# EAGLE design W024 (EAGLE 6.6.0)
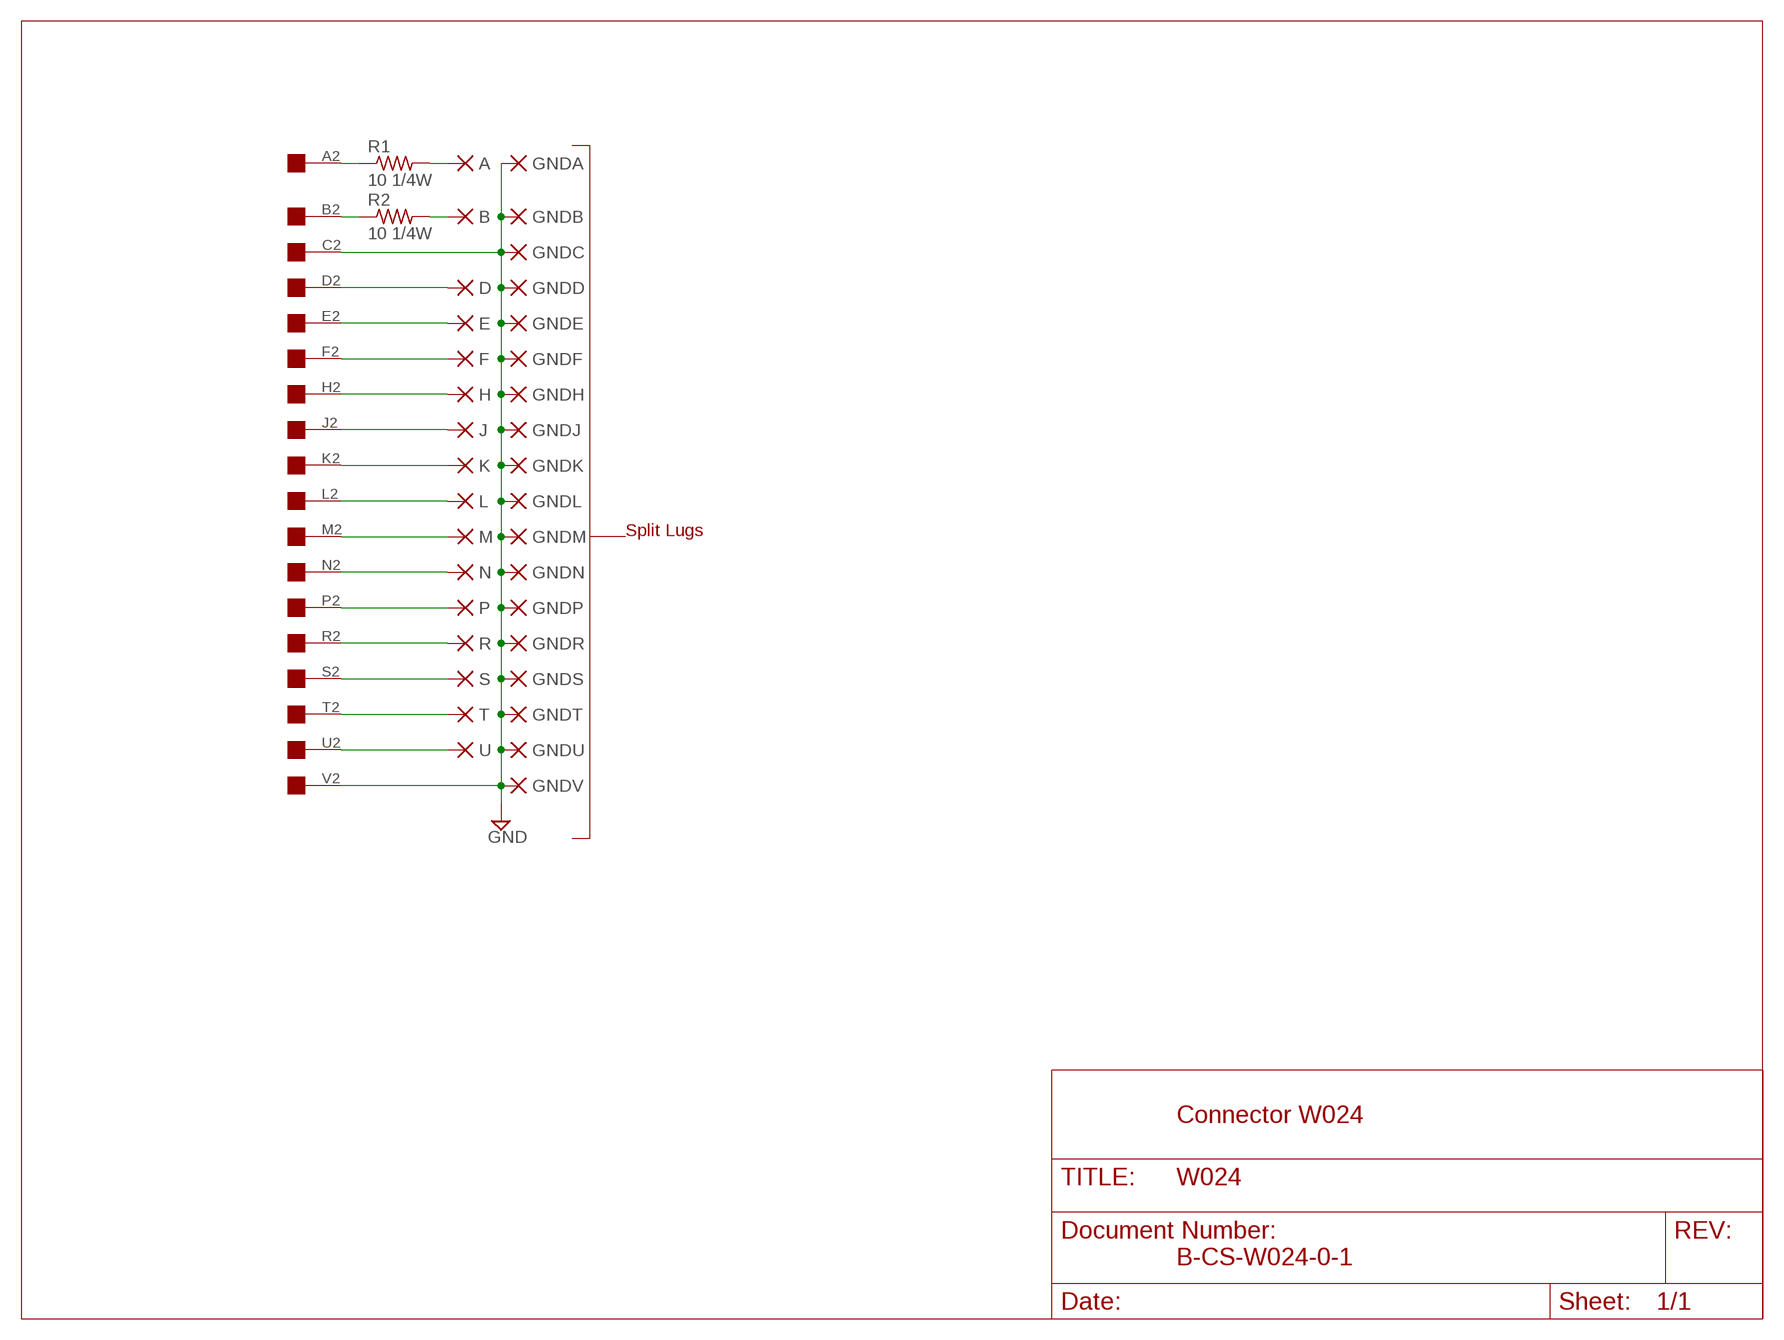
[diagram p0: schematic, sheet 1]

## Parts
A  PAD-0465  [0465]
B  PAD-0465  [0465]
D  PAD-0465  [0465]
E  PAD-0465  [0465]
F  PAD-0465  [0465]
GNDA  PAD-0465  [0465]
GNDB  PAD-0465  [0465]
GNDC  PAD-0465  [0465]
GNDD  PAD-0465  [0465]
GNDE  PAD-0465  [0465]
GNDF  PAD-0465  [0465]
GNDH  PAD-0465  [0465]
GNDJ  PAD-0465  [0465]
GNDK  PAD-0465  [0465]
GNDL  PAD-0465  [0465]
GNDM  PAD-0465  [0465]
GNDN  PAD-0465  [0465]
GNDP  PAD-0465  [0465]
GNDR  PAD-0465  [0465]
GNDS  PAD-0465  [0465]
GNDT  PAD-0465  [0465]
GNDU  PAD-0465  [0465]
GNDV  PAD-0465  [0465]
H  PAD-0465  [0465]
J  PAD-0465  [0465]
K  PAD-0465  [0465]
L  PAD-0465  [0465]
M  PAD-0465  [0465]
N  PAD-0465  [0465]
P  PAD-0465  [0465]
R  PAD-0465  [0465]
R1  10 1/4W  R-US_0207/10  [0207/10]
R2  10 1/4W  R-US_0207/10  [0207/10]
S  PAD-0465  [0465]
T  PAD-0465  [0465]
U  PAD-0465  [0465]
U$2  EDGE-1  [EDGE-CON1]

## Nets
GND [Supply]: GNDA.P$1(P) GNDB.P$1(P) GNDC.P$1(P) GNDD.P$1(P) GNDE.P$1(P) GNDF.P$1(P) GNDH.P$1(P) GNDJ.P$1(P) GNDK.P$1(P) GNDL.P$1(P) GNDM.P$1(P) GNDN.P$1(P) GNDP.P$1(P) GNDR.P$1(P) GNDS.P$1(P) GNDT.P$1(P) GNDU.P$1(P) GNDV.P$1(P) U$2.C2 U$2.V2
N$1 [Supply]: E.P$1(P) U$2.E2
N$2 [Supply]: H.P$1(P) U$2.H2
N$3 [Supply]: K.P$1(P) U$2.K2
N$4 [Supply]: M.P$1(P) U$2.M2
N$5 [Supply]: P.P$1(P) U$2.P2
N$6 [Supply]: S.P$1(P) U$2.S2
N$7 [Supply]: T.P$1(P) U$2.T2
N$9: D.P$1(P) U$2.D2
N$10: R2.1 U$2.B2
N$11: R1.1 U$2.A2
N$12: A.P$1(P) R1.2
N$13: B.P$1(P) R2.2
N$15 [Supply]: F.P$1(P) U$2.F2
N$16 [Supply]: J.P$1(P) U$2.J2
N$17 [Supply]: L.P$1(P) U$2.L2
N$18 [Supply]: N.P$1(P) U$2.N2
N$19 [Supply]: R.P$1(P) U$2.R2
N$20 [Supply]: U$2.U2 U.P$1(P)

## Notes on the sheet
- Split Lugs
- Connector W024
- B-CS-W024-0-1

## Library data of the parts
A B D E F GNDA GNDB GNDC GNDD GNDE GNDF GNDH GNDJ GNDK GNDL GNDM GNDN GNDP GNDR GNDS GNDT GNDU GNDV H J K L M N P R S T U = dec-con:PAD: WIRE PAD Standard US Drill Sizes
R1 R2 = rcl:R-US_: RESISTOR, American symbol
U$2 = dec-con:EDGE-1: Single-Sided DEC Edge Connector -- (side 2)

## Net classes
1 Supply: width 0.813 mm

## Board
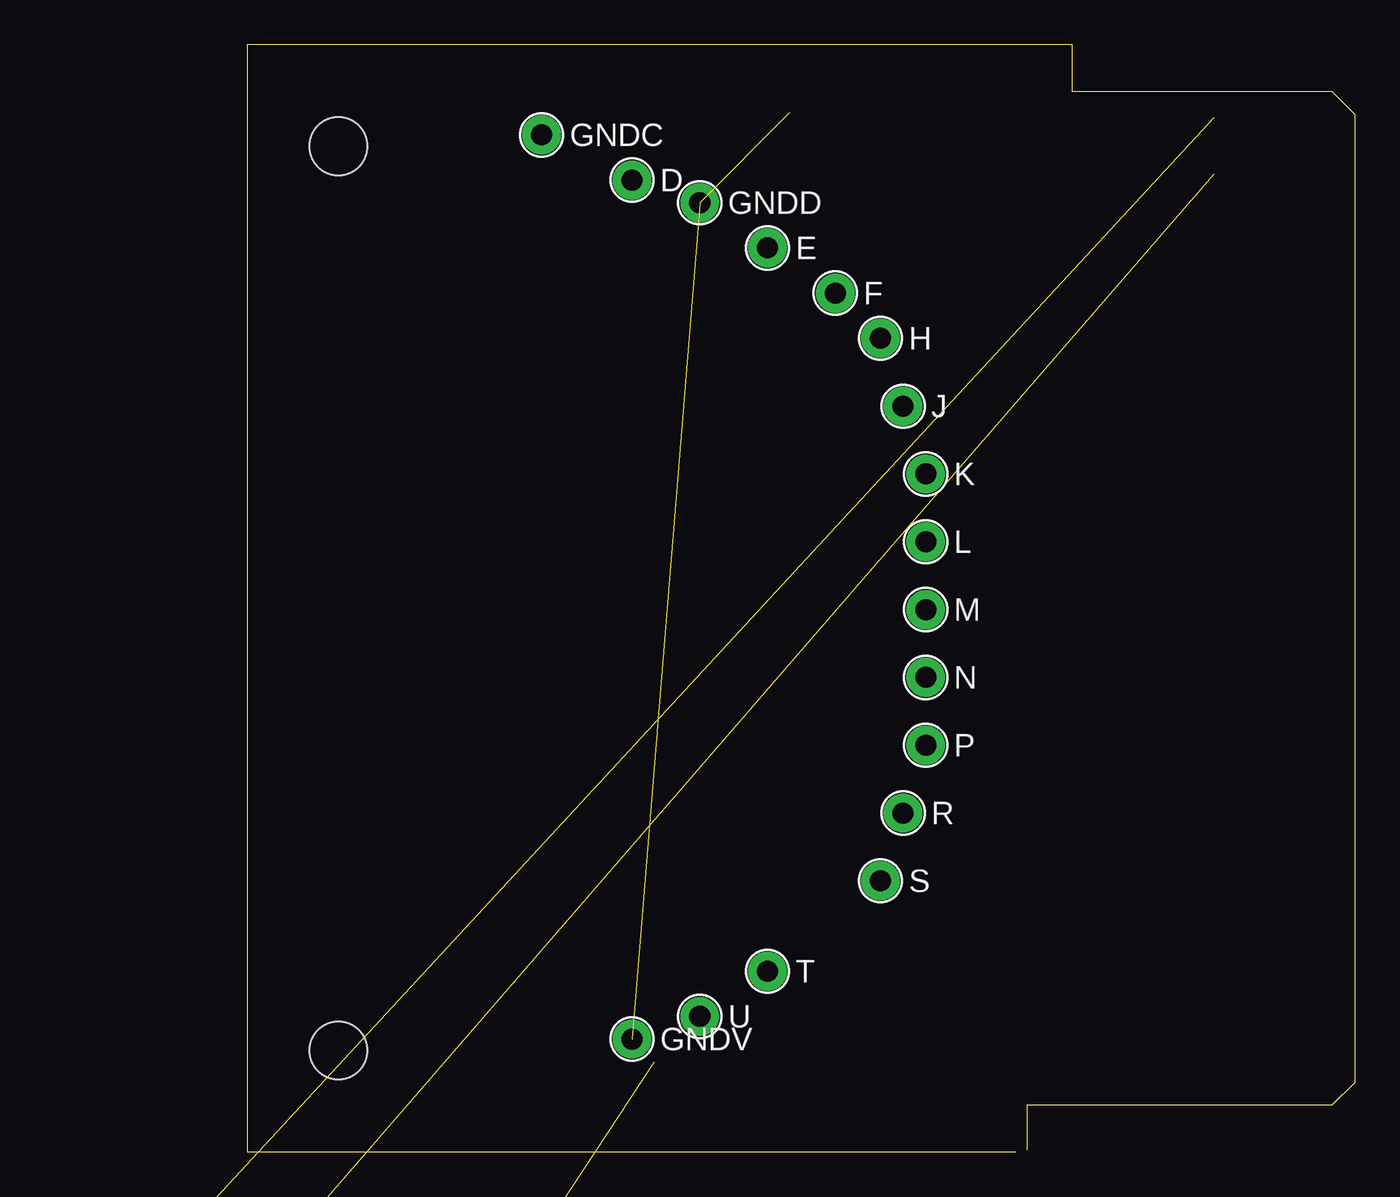
[diagram p1: board, top side]
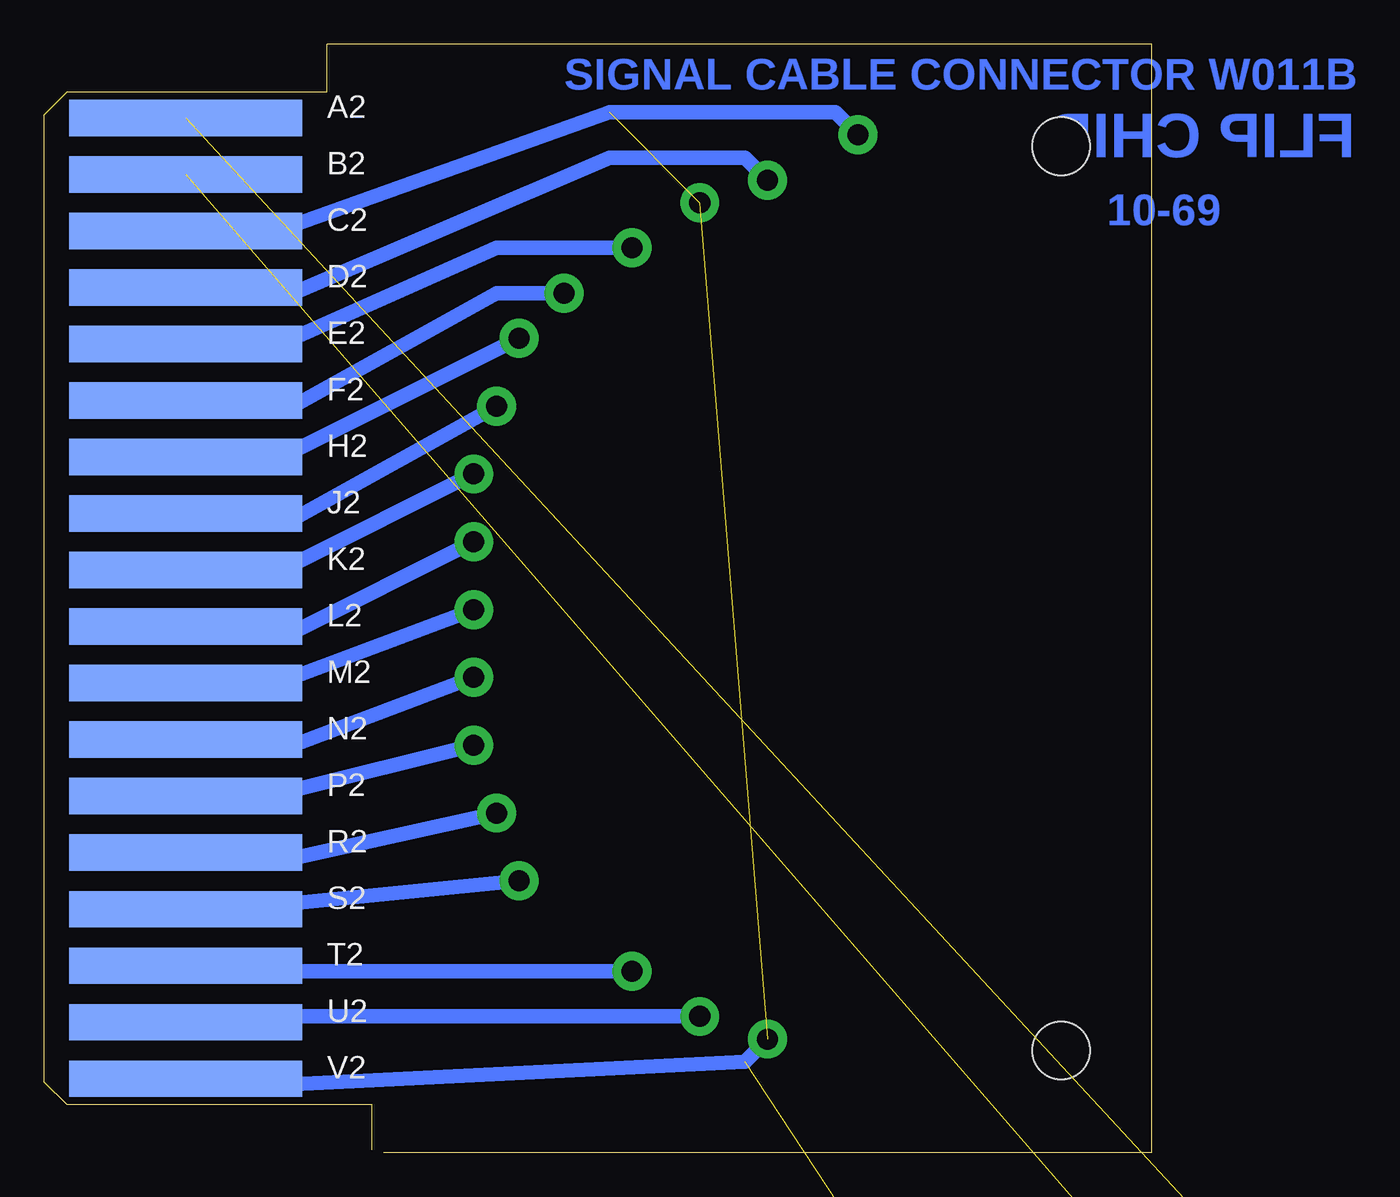
[diagram p2: board, bottom side, seen from below]

Size 62.23 x 62.23 mm. Coordinates in mm from the lower left corner, seen from the top.
Outline: 43.18,0 0,0 0,62.23 46.35,62.23
Copper layers (1+16): Top 0.035mm / dielectric 1.5mm / Bottom 0.035mm
Design rules "16mils": minimum track width 16mil, minimum drill 32mil, track to track 15mil, track to pad 10mil, pad to pad 10mil, via to via 10mil, smd to smd 10mil, copper to edge 13mil, drill to drill 10mil, minimum pad ring 10mil, minimum via ring 8mil, stop-mask expansion 0mil, vias tented up to drill 0mil, thermal gap 10mil
Holes 3.25 mm at 5.08,56.52 5.08,5.71

### Footprints (pad centres in the part's own frame; a part is rotated, then mirrored left to right if it is on the bottom)
0465 = drill 1.181 pad 2.184: P$1 0,0
0207/10 = drill 0.813 octagon: 1 -5.08,0; 2 5.08,0
EDGE-CON1 = smd 13.106 x 2.032 bottom: A2 7.938,4.128; B2 7.938,7.303; C2 7.938,10.477; D2 7.938,13.652; E2 7.938,16.828; F2 7.938,20.003; H2 7.938,23.177; J2 7.938,26.352; K2 7.938,29.527; L2 7.938,32.703; M2 7.938,35.877; N2 7.938,39.053; P2 7.938,42.227; R2 7.938,45.403; S2 7.938,48.578; T2 7.938,51.752; U2 7.938,54.928; V2 7.938,58.102

### Placement (x,y rotation side)
A  -6.35,-24.13 0 top  (outside the outline)
B  -6.35,-31.75 0 top  (outside the outline)
D  21.59,54.61 0 top
E  29.21,50.8 0 top
F  33.02,48.26 0 top
GNDA  -6.35,-46.99 0 top  (outside the outline)
GNDB  -6.35,-39.37 0 top  (outside the outline)
GNDC  16.51,57.15 0 top
GNDD  25.4,53.34 0 top
GNDE  -6.35,-54.61 0 top  (outside the outline)
GNDF  -6.35,-62.23 0 top  (outside the outline)
GNDH  -6.35,-69.85 0 top  (outside the outline)
GNDJ  -6.35,-77.47 0 top  (outside the outline)
GNDK  -6.35,-85.09 0 top  (outside the outline)
GNDL  -6.35,-92.71 0 top  (outside the outline)
GNDM  -6.35,-100.33 0 top  (outside the outline)
GNDN  -6.35,-107.95 0 top  (outside the outline)
GNDP  -6.35,-115.57 0 top  (outside the outline)
GNDR  -6.35,-123.19 0 top  (outside the outline)
GNDS  -6.35,-130.81 0 top  (outside the outline)
GNDT  -6.35,-138.43 0 top  (outside the outline)
GNDU  -6.35,-146.05 0 top  (outside the outline)
GNDV  21.59,6.35 0 top
H  35.56,45.72 0 top
J  36.83,41.91 0 top
K  38.1,38.1 0 top
L  38.1,34.29 0 top
M  38.1,30.48 0 top
N  38.1,26.67 0 top
P  38.1,22.86 0 top
R  36.83,19.05 0 top
R1  -2.54,-8.89 0 top  (outside the outline)
R2  -2.54,-16.51 0 top  (outside the outline)
S  35.56,15.24 0 top
T  29.21,10.16 0 top
U  25.4,7.62 0 top
U$2  62.23,62.23 180 top

### Tracks (layer width: path | path; a pad name or v marks a point on that pad's centre or on a via)
GND  (17 unrouted)
  Bottom 0.813: U$2.C2 53.34,52.07 48.26,52.07 30.48,58.42 17.78,58.42 GNDC.P$1 | U$2.V2 53.34,3.81 48.26,3.81 22.86,5.08 GNDV.P$1
N$1
  Bottom 0.813: U$2.E2 53.34,45.72 48.26,45.72 36.83,50.8 E.P$1
N$2
  Bottom 0.813: U$2.H2 53.34,39.37 48.26,39.37 H.P$1
N$3
  Bottom 0.813: U$2.K2 53.34,33.02 48.26,33.02 K.P$1
N$4
  Bottom 0.813: U$2.M2 53.34,26.67 48.26,26.67 M.P$1
N$5
  Bottom 0.813: U$2.P2 53.67,19.99 53.34,20.32 48.26,20.32 P.P$1
N$6
  Bottom 0.813: U$2.S2 53.34,13.97 48.26,13.97 S.P$1
N$7
  Bottom 0.813: U$2.T2 53.34,10.16 T.P$1
N$9
  Bottom 0.813: U$2.D2 53.34,48.26 48.26,48.26 30.48,55.88 22.86,55.88 D.P$1
N$10  (1 unrouted)
N$11  (1 unrouted)
N$12  (1 unrouted)
N$13  (1 unrouted)
N$15
  Bottom 0.813: U$2.F2 53.34,41.91 48.26,41.91 36.83,48.26 F.P$1
N$16
  Bottom 0.813: U$2.J2 53.34,35.56 48.26,35.56 J.P$1
N$17
  Bottom 0.813: U$2.L2 53.34,29.21 48.26,29.21 L.P$1
N$18
  Bottom 0.813: U$2.N2 53.34,22.86 48.26,22.86 N.P$1
N$19
  Bottom 0.813: U$2.R2 53.34,16.51 48.26,16.51 R.P$1
N$20
  Bottom 0.813: U$2.U2 53.34,7.62 U.P$1

### Text on the board
Bottom: SIGNAL CABLE CONNECTOR W011B | FLIP CHIP | 10-69